# Altium project T1-T0ast.X2.PrjPcb (part 2 of 2)

## Sheet USB_SATA.SchDoc
size B; SheetNumber: 6; SheetTotal: 10
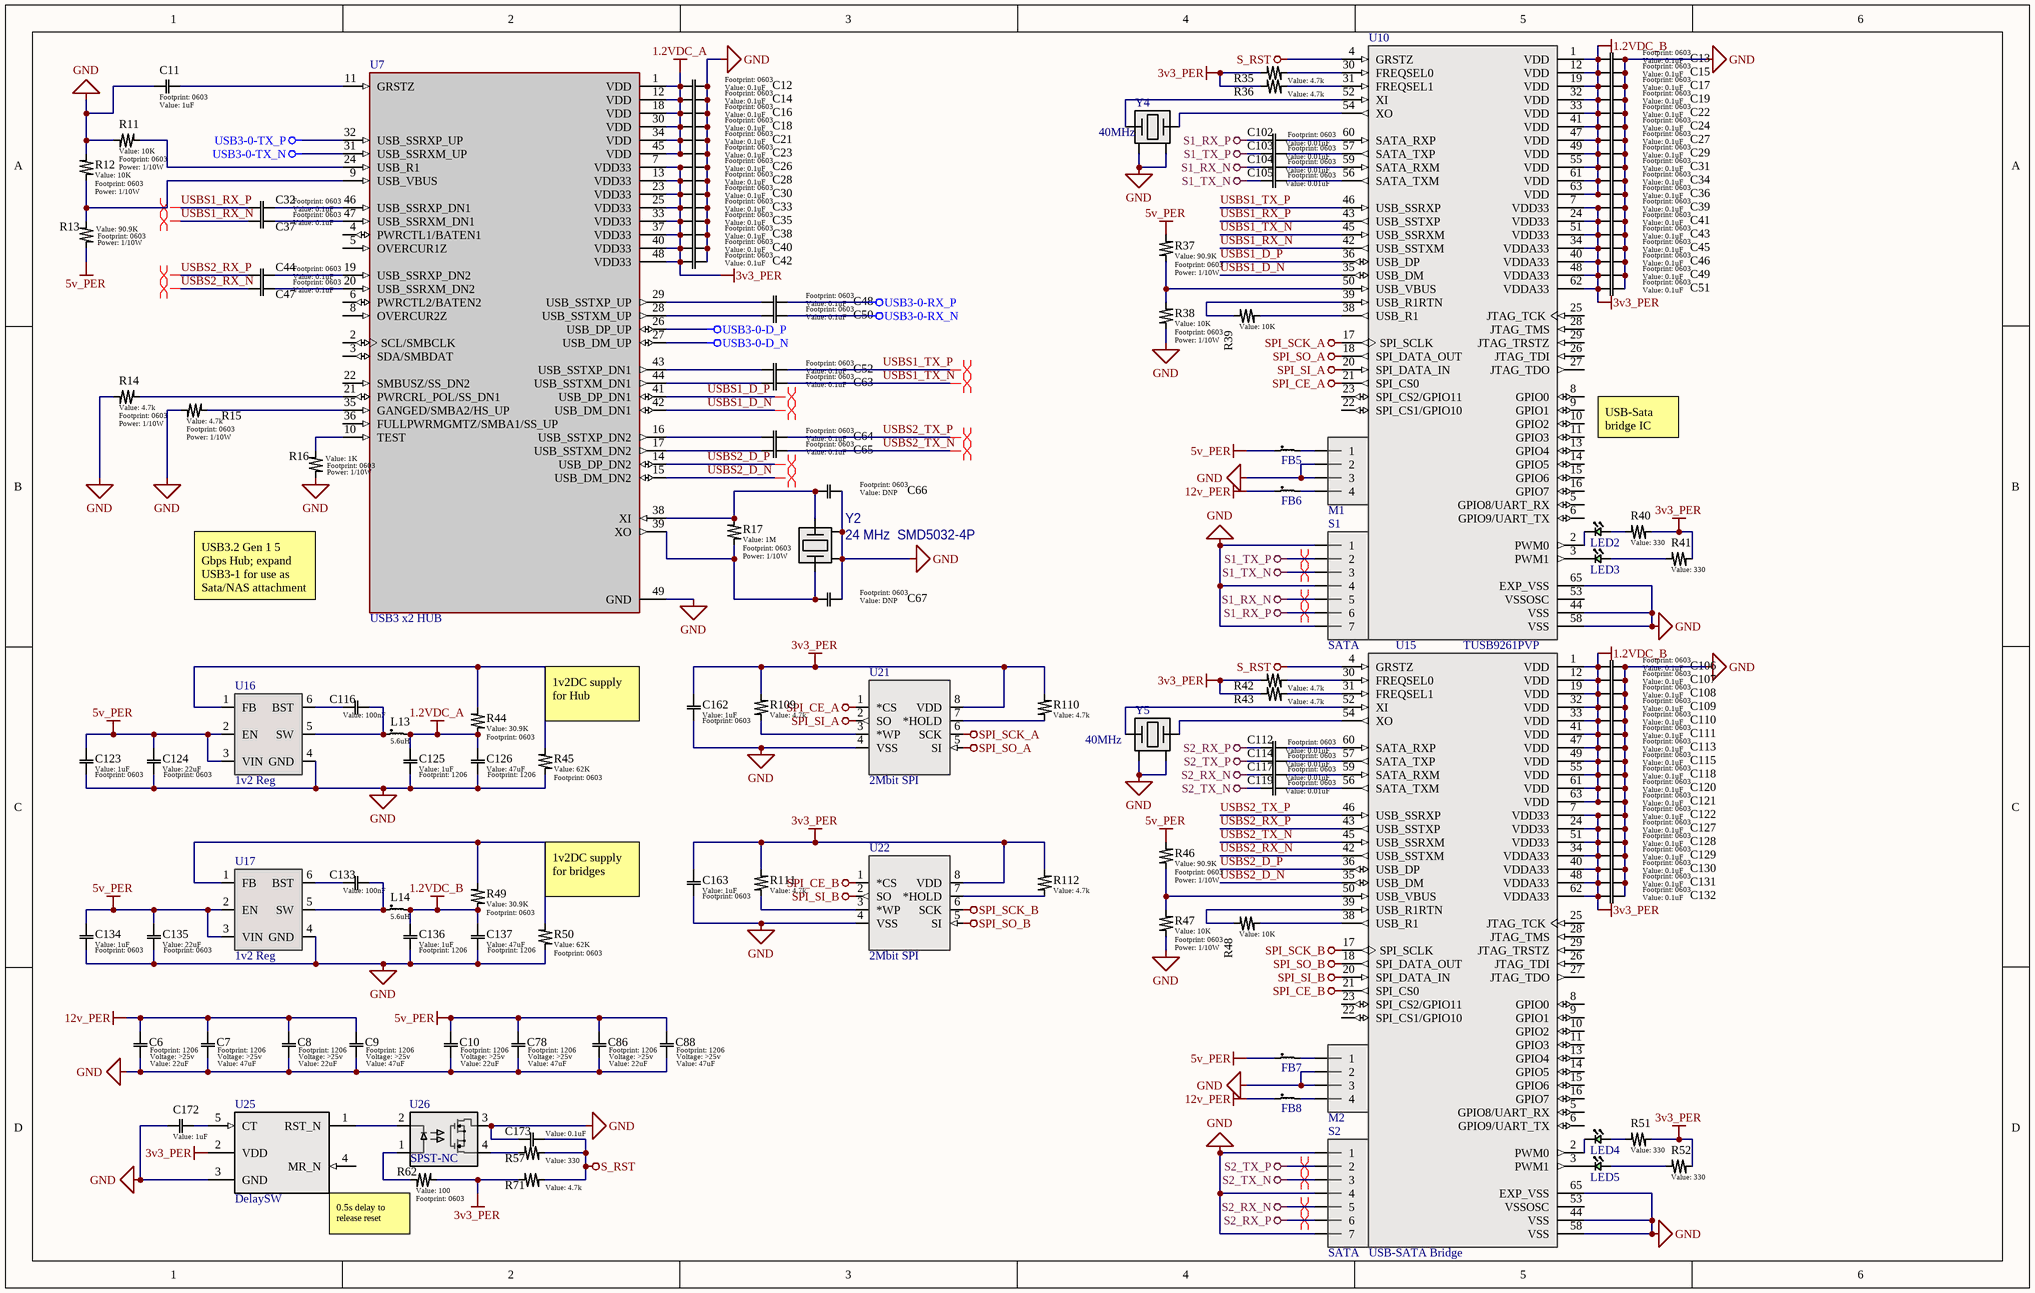
[diagram p3: USB_SATA.SchDoc]

### Parts
C6  value 22uF  Voltage: >25v  [1206]  (hidden comment: Generic Capacitor)
C7  value 47uF  Voltage: >25v  [1206]  (hidden comment: Generic Capacitor)
C8  value 22uF  Voltage: >25v  [1206]  (hidden comment: Generic Capacitor)
C9  value 47uF  Voltage: >25v  [1206]  (hidden comment: Generic Capacitor)
C10  value 22uF  Voltage: >25v  [1206]  (hidden comment: Generic Capacitor)
C11  value 1uF  [0603]  (hidden comment: Generic Capacitor)
C12  value 0.1uF  [0603]  (hidden comment: Generic Capacitor)
C13  value 0.1uF  [0603]  (hidden comment: Generic Capacitor)
C14  value 0.1uF  [0603]  (hidden comment: Generic Capacitor)
C15  value 0.1uF  [0603]  (hidden comment: Generic Capacitor)
C16  value 0.1uF  [0603]  (hidden comment: Generic Capacitor)
C17  value 0.1uF  [0603]  (hidden comment: Generic Capacitor)
C18  value 0.1uF  [0603]  (hidden comment: Generic Capacitor)
C19  value 0.1uF  [0603]  (hidden comment: Generic Capacitor)
C21  value 0.1uF  [0603]  (hidden comment: Generic Capacitor)
C22  value 0.1uF  [0603]  (hidden comment: Generic Capacitor)
C23  value 0.1uF  [0603]  (hidden comment: Generic Capacitor)
C24  value 0.1uF  [0603]  (hidden comment: Generic Capacitor)
C26  value 0.1uF  [0603]  (hidden comment: Generic Capacitor)
C27  value 0.1uF  [0603]  (hidden comment: Generic Capacitor)
C28  value 0.1uF  [0603]  (hidden comment: Generic Capacitor)
C29  value 0.1uF  [0603]  (hidden comment: Generic Capacitor)
C30  value 0.1uF  [0603]  (hidden comment: Generic Capacitor)
C31  value 0.1uF  [0603]  (hidden comment: Generic Capacitor)
C32  value 0.1uF  [0603]  (hidden comment: Generic Capacitor)
C33  value 0.1uF  [0603]  (hidden comment: Generic Capacitor)
C34  value 0.1uF  [0603]  (hidden comment: Generic Capacitor)
C35  value 0.1uF  [0603]  (hidden comment: Generic Capacitor)
C36  value 0.1uF  [0603]  (hidden comment: Generic Capacitor)
C37  value 0.1uF  [0603]  (hidden comment: Generic Capacitor)
C38  value 0.1uF  [0603]  (hidden comment: Generic Capacitor)
C39  value 0.1uF  [0603]  (hidden comment: Generic Capacitor)
C40  value 0.1uF  [0603]  (hidden comment: Generic Capacitor)
C41  value 0.1uF  [0603]  (hidden comment: Generic Capacitor)
C42  value 0.1uF  [0603]  (hidden comment: Generic Capacitor)
C43  value 0.1uF  [0603]  (hidden comment: Generic Capacitor)
C44  value 0.1uF  [0603]  (hidden comment: Generic Capacitor)
C45  value 0.1uF  [0603]  (hidden comment: Generic Capacitor)
C46  value 0.1uF  [0603]  (hidden comment: Generic Capacitor)
C47  value 0.1uF  [0603]  (hidden comment: Generic Capacitor)
C48  value 0.1uF  [0603]  (hidden comment: Generic Capacitor)
C49  value 0.1uF  [0603]  (hidden comment: Generic Capacitor)
C50  value 0.1uF  [0603]  (hidden comment: Generic Capacitor)
C51  value 0.1uF  [0603]  (hidden comment: Generic Capacitor)
C52  value 0.1uF  [0603]  (hidden comment: Generic Capacitor)
C63  value 0.1uF  [0603]  (hidden comment: Generic Capacitor)
C64  value 0.1uF  [0603]  (hidden comment: Generic Capacitor)
C65  value 0.1uF  [0603]  (hidden comment: Generic Capacitor)
C66  value DNP  [0603]  (hidden comment: Generic Capacitor)
C67  value DNP  [0603]  (hidden comment: Generic Capacitor)
C78  value 47uF  Voltage: >25v  [1206]  (hidden comment: Generic Capacitor)
C86  value 22uF  Voltage: >25v  [1206]  (hidden comment: Generic Capacitor)
C88  value 47uF  Voltage: >25v  [1206]  (hidden comment: Generic Capacitor)
C102  value 0.01uF  [0603]  (hidden comment: Generic Capacitor)
C103  value 0.01uF  [0603]  (hidden comment: Generic Capacitor)
C104  value 0.01uF  [0603]  (hidden comment: Generic Capacitor)
C105  value 0.01uF  [0603]  (hidden comment: Generic Capacitor)
C106  value 0.1uF  [0603]  (hidden comment: Generic Capacitor)
C107  value 0.1uF  [0603]  (hidden comment: Generic Capacitor)
C108  value 0.1uF  [0603]  (hidden comment: Generic Capacitor)
C109  value 0.1uF  [0603]  (hidden comment: Generic Capacitor)
C110  value 0.1uF  [0603]  (hidden comment: Generic Capacitor)
C111  value 0.1uF  [0603]  (hidden comment: Generic Capacitor)
C112  value 0.01uF  [0603]  (hidden comment: Generic Capacitor)
C113  value 0.1uF  [0603]  (hidden comment: Generic Capacitor)
C114  value 0.01uF  [0603]  (hidden comment: Generic Capacitor)
C115  value 0.1uF  [0603]  (hidden comment: Generic Capacitor)
C116  value 100nF  [0603]  (hidden comment: Generic Capacitor)
C117  value 0.01uF  [0603]  (hidden comment: Generic Capacitor)
C118  value 0.1uF  [0603]  (hidden comment: Generic Capacitor)
C119  value 0.01uF  [0603]  (hidden comment: Generic Capacitor)
C120  value 0.1uF  [0603]  (hidden comment: Generic Capacitor)
C121  value 0.1uF  [0603]  (hidden comment: Generic Capacitor)
C122  value 0.1uF  [0603]  (hidden comment: Generic Capacitor)
C123  value 1uF  [0603]  (hidden comment: Generic Capacitor)
C124  value 22uF  [0603]  (hidden comment: Generic Capacitor)
C125  value 1uF  [1206]  (hidden comment: Generic Capacitor)
C126  value 47uF  [1206]  (hidden comment: Generic Capacitor)
C127  value 0.1uF  [0603]  (hidden comment: Generic Capacitor)
C128  value 0.1uF  [0603]  (hidden comment: Generic Capacitor)
C129  value 0.1uF  [0603]  (hidden comment: Generic Capacitor)
C130  value 0.1uF  [0603]  (hidden comment: Generic Capacitor)
C131  value 0.1uF  [0603]  (hidden comment: Generic Capacitor)
C132  value 0.1uF  [0603]  (hidden comment: Generic Capacitor)
C133  value 100nF  [0603]  (hidden comment: Generic Capacitor)
C134  value 1uF  [0603]  (hidden comment: Generic Capacitor)
C135  value 22uF  [0603]  (hidden comment: Generic Capacitor)
C136  value 1uF  [1206]  (hidden comment: Generic Capacitor)
C137  value 47uF  [1206]  (hidden comment: Generic Capacitor)
C162  value 1uF  [0603]  (hidden comment: Generic Capacitor)
C163  value 1uF  [0603]  (hidden comment: Generic Capacitor)
C172  value 1uF  [0603]  (hidden comment: Generic Capacitor)
C173  value 0.1uF  [0603]  (hidden comment: Generic Capacitor)
FB5  1206 Ferrite  [1206]  (value not drawn)
FB6  1206 Ferrite  [1206]  (value not drawn)
FB7  1206 Ferrite  [1206]  (value not drawn)
FB8  1206 Ferrite  [1206]  (value not drawn)
L13  5.6uH  [TMPC0402HP]
L14  5.6uH  [TMPC0402HP]
LED2  LTST-C191KGKT  [0603 (1608 Metric) Concave]  (value not drawn)
LED3  LTST-C191KGKT  [0603 (1608 Metric) Concave]  (value not drawn)
LED4  LTST-C191KGKT  [0603 (1608 Metric) Concave]  (value not drawn)
LED5  LTST-C191KGKT  [0603 (1608 Metric) Concave]  (value not drawn)
M1  MATE-n-Lock  [794287-1]  (value not drawn)
M2  MATE-n-Lock  [794287-1]  (value not drawn)
R11  value 10K  Power: 1/10W  [0603]  (hidden comment: Generic Resistor)
R12  value 10K  Power: 1/10W  [0603]  (hidden comment: Generic Resistor)
R13  value 90.9K  Power: 1/10W  [0603]  (hidden comment: Generic Resistor)
R14  value 4.7k  Power: 1/10W  [0603]  (hidden comment: Generic Resistor)
R15  value 4.7k  Power: 1/10W  [0603]  (hidden comment: Generic Resistor)
R16  value 1K  Power: 1/10W  [0603]  (hidden comment: Generic Resistor)
R17  value 1M  Power: 1/10W  [0603]  (hidden comment: Generic Resistor)
R35  value 4.7k  [0603]  (hidden comment: Generic Resistor)
R36  value 4.7k  [0603]  (hidden comment: Generic Resistor)
R37  value 90.9K  Power: 1/10W  [0603]  (hidden comment: Generic Resistor)
R38  value 10K  Power: 1/10W  [0603]  (hidden comment: Generic Resistor)
R39  value 10K  [0603]  (hidden comment: Generic Resistor)
R40  value 330  [0603]  (hidden comment: Generic Resistor)
R41  value 330  [0603]  (hidden comment: Generic Resistor)
R42  value 4.7k  [0603]  (hidden comment: Generic Resistor)
R43  value 4.7k  [0603]  (hidden comment: Generic Resistor)
R44  value 30.9K  [0603]  (hidden comment: Generic Resistor)
R45  value 62K  [0603]  (hidden comment: Generic Resistor)
R46  value 90.9K  Power: 1/10W  [0603]  (hidden comment: Generic Resistor)
R47  value 10K  Power: 1/10W  [0603]  (hidden comment: Generic Resistor)
R48  value 10K  [0603]  (hidden comment: Generic Resistor)
R49  value 30.9K  [0603]  (hidden comment: Generic Resistor)
R50  value 62K  [0603]  (hidden comment: Generic Resistor)
R51  value 330  [0603]  (hidden comment: Generic Resistor)
R52  value 330  [0603]  (hidden comment: Generic Resistor)
R57  value 330  [0603]  (hidden comment: Generic Resistor)
R62  value 100  [0603]  (hidden comment: Generic Resistor)
R71  value 4.7k  [0603]  (hidden comment: Generic Resistor)
R109  value 4.7k  [0603]  (hidden comment: Generic Resistor)
R110  value 4.7k  [0603]  (hidden comment: Generic Resistor)
R111  value 4.7k  [0603]  (hidden comment: Generic Resistor)
R112  value 4.7k  [0603]  (hidden comment: Generic Resistor)
S1  SATA  [67800-8025]
S2  SATA  [67800-8025]
U7  USB3 x2 HUB  [HTQFP-48(7x7)]
U10  USB-SATA Bridge  [64-HTQFP (7x7)]  (value not drawn)
U15  USB-SATA Bridge  [64-HTQFP (7x7)]
U16  1v2 Reg  [TSOT-23-6]
U17  1v2 Reg  [TSOT-23-6]
U21  2Mbit SPI  [8-SOIC (0.154", 3.90mm Width)]
U22  2Mbit SPI  [8-SOIC (0.154", 3.90mm Width)]
U25  DelaySW  [TSOT-23-5]
U26  SPST-NC  [4-SOP]
Y2  24 MHz  SMD5032-4P  [ECS-240-18-30BQ-DS]
Y4  40MHz  [SMD3225-4P]
Y5  40MHz  [SMD3225-4P]

### Nets
1.2VDC_A: C12.2 C14.2 C16.2 C18.2 C21.2 C23.2 C125.1 C126.1 L13.2 R44.1 U7.1(VDD) U7.12(VDD) U7.18(VDD) U7.30(VDD) U7.34(VDD) U7.45(VDD)
1.2VDC_B: C13.2 C15.2 C17.2 C19.2 C22.2 C24.2 C27.2 C29.2 C31.2 C34.2 C36.2 C106.2 C107.2 C108.2 C109.2 C110.2 C111.2 C113.2 C115.2 C118.2 C120.2 C121.2 C136.1 C137.1 L14.2 R49.1 U10.1(VDD) U10.12(VDD) U10.19(VDD) U10.32(VDD) U10.33(VDD) U10.41(VDD) U10.47(VDD) U10.49(VDD) U10.55(VDD) U10.61(VDD) U10.63(VDD) U15.1(VDD) U15.12(VDD) U15.19(VDD) U15.32(VDD) U15.33(VDD) U15.41(VDD) U15.47(VDD) U15.49(VDD) U15.55(VDD) U15.61(VDD) U15.63(VDD)
3v3_PER: C26.2 C28.2 C30.2 C33.2 C35.2 C38.2 C39.2 C40.2 C41.2 C42.2 C43.2 C45.2 C46.2 C49.2 C51.2 C122.2 C127.2 C128.2 C129.2 C130.2 C131.2 C132.2 C162.1 C163.1 R35.1 R36.1 R40.2 R41.2 R42.1 R43.1 R51.2 R52.2 R62.2 R71.1 R109.1 R110.1 R111.1 R112.1 U7.7(VDD33) U7.13(VDD33) U7.23(VDD33) U7.25(VDD33) U7.33(VDD33) U7.37(VDD33) U7.40(VDD33) U7.48(VDD33) U10.7(VDD33) U10.24(VDD33) U10.34(VDDA33) U10.40(VDDA33) U10.48(VDDA33) U10.51(VDD33) U10.62(VDDA33) U15.7(VDD33) U15.24(VDD33) U15.34(VDDA33) U15.40(VDDA33) U15.48(VDDA33) U15.51(VDD33) U15.62(VDDA33) U21.8(VDD) U22.8(VDD) U25.2(VDD)
5v_PER: C10.1 C78.1 C86.1 C88.1 C123.1 C124.1 C134.1 C135.1 FB5.1 FB7.1 R13.1 R37.1 R46.1 U16.2(EN) U16.3(VIN) U17.2(EN) U17.3(VIN)
12v_PER: C6.1 C7.1 C8.1 C9.1 FB6.1 FB8.1
GND: C6.2 C7.2 C8.2 C9.2 C10.2 C11.1 C12.1 C13.1 C14.1 C15.1 C16.1 C17.1 C18.1 C19.1 C21.1 C22.1 C23.1 C24.1 C26.1 C27.1 C28.1 C29.1 C30.1 C31.1 C33.1 C34.1 C35.1 C36.1 C38.1 C39.1 C40.1 C41.1 C42.1 C43.1 C45.1 C46.1 C49.1 C51.1 C66.1 C67.1 C78.2 C86.2 C88.2 C106.1 C107.1 C108.1 C109.1 C110.1 C111.1 C113.1 C115.1 C118.1 C120.1 C121.1 C122.1 C123.2 C124.2 C125.2 C126.2 C127.1 C128.1 C129.1 C130.1 C131.1 C132.1 C134.2 C135.2 C136.2 C137.2 C162.2 C163.2 C172.2 C173.1 M1.2 M1.3 M2.2 M2.3 R11.1 R12.1 R14.1 R15.1 R16.1 R38.1 R45.1 R47.1 R50.1 S1.1 S1.4 S1.7 S2.1 S2.4 S2.7 U7.49(GND) U10.44(VSS) U10.58(VSS) U10.65(EXP_VSS) U15.44(VSS) U15.58(VSS) U15.65(EXP_VSS) U16.4(GND) U17.4(GND) U21.4(VSS) U22.4(VSS) U25.3(GND) U26.3 Y2.2(GND) Y2.4(GND) Y4.2(GND) Y4.4(GND) Y5.2(GND) Y5.4(GND)
S1_RX_N: C104.2 S1.5
S1_RX_P: C102.2 S1.6
S1_TX_N: C105.2 S1.3
S1_TX_P: C103.2 S1.2
S2_RX_N: C117.2 S2.5
S2_RX_P: C112.2 S2.6
S2_TX_N: C119.2 S2.3
S2_TX_P: C114.2 S2.2
S_RST: C173.2 R57.2 R71.2 U10.4(GRSTZ) U15.4(GRSTZ)
SPI_CE_A: U10.21(SPI_CS0) U21.1(*CS)
SPI_CE_B: U15.21(SPI_CS0) U22.1(*CS)
SPI_SCK_A: U10.17(SPI_SCLK) U21.6(SCK)
SPI_SCK_B: U15.17(SPI_SCLK) U22.6(SCK)
SPI_SI_A: U10.20(SPI_DATA_IN) U21.2(SO)
SPI_SI_B: U15.20(SPI_DATA_IN) U22.2(SO)
SPI_SO_A: U10.18(SPI_DATA_OUT) U21.5(SI)
SPI_SO_B: U15.18(SPI_DATA_OUT) U22.5(SI)
USB3-0-D_N: U7.27(USB_DM_UP)
USB3-0-D_P: U7.26(USB_DP_UP)
USB3-0-RX_N: C50.1
USB3-0-RX_P: C48.1
USB3-0-TX_N: U7.31(USB_SSRXM_UP)
USB3-0-TX_P: U7.32(USB_SSRXP_UP)
USBS1_D_N: U7.42(USB_DM_DN1) U10.35(USB_DM)
USBS1_D_P: U7.41(USB_DP_DN1) U10.36(USB_DP)
USBS1_RX_N: C37.2 U10.42(USB_SSTXM)
USBS1_RX_P: C32.2 U10.43(USB_SSTXP)
USBS1_TX_N: C63.1 U10.45(USB_SSRXM)
USBS1_TX_P: C52.1 U10.46(USB_SSRXP)
USBS2_D_N: U7.15(USB_DM_DN2) U15.35(USB_DM)
USBS2_D_P: U7.14(USB_DP_DN2) U15.36(USB_DP)
USBS2_RX_N: C47.2 U15.42(USB_SSTXM)
USBS2_RX_P: C44.2 U15.43(USB_SSTXP)
USBS2_TX_N: C65.1 U15.45(USB_SSRXM)
USBS2_TX_P: C64.1 U15.46(USB_SSRXP)
NetC11_2: C11.2 U7.11(GRSTZ)
NetC32_1: C32.1 U7.46(USB_SSRXP_DN1)
NetC37_1: C37.1 U7.47(USB_SSRXM_DN1)
NetC44_1: C44.1 U7.19(USB_SSRXP_DN2)
NetC47_1: C47.1 U7.20(USB_SSRXM_DN2)
NetC48_2: C48.2 U7.29(USB_SSTXP_UP)
NetC50_2: C50.2 U7.28(USB_SSTXM_UP)
NetC52_2: C52.2 U7.43(USB_SSTXP_DN1)
NetC63_2: C63.2 U7.44(USB_SSTXM_DN1)
NetC64_2: C64.2 U7.16(USB_SSTXP_DN2)
NetC65_2: C65.2 U7.17(USB_SSTXM_DN2)
NetC66_2: C66.2 R17.1 U7.38(XI) Y2.3
NetC67_2: C67.2 R17.2 U7.39(XO) Y2.1
NetC102_1: C102.1 U10.60(SATA_RXP)
NetC103_1: C103.1 U10.57(SATA_TXP)
NetC104_1: C104.1 U10.59(SATA_RXM)
NetC105_1: C105.1 U10.56(SATA_TXM)
NetC112_1: C112.1 U15.60(SATA_RXP)
NetC114_1: C114.1 U15.57(SATA_TXP)
NetC116_1: C116.1 U16.6(BST)
NetC116_2: C116.2 L13.1 U16.5(SW)
NetC117_1: C117.1 U15.59(SATA_RXM)
NetC119_1: C119.1 U15.56(SATA_TXM)
NetC133_1: C133.1 U17.6(BST)
NetC133_2: C133.2 L14.1 U17.5(SW)
NetC172_1: C172.1 U25.5(CT)
NetFB5_2: FB5.2 M1.1
NetFB6_2: FB6.2 M1.4
NetFB7_2: FB7.2 M2.1
NetFB8_2: FB8.2 M2.4
NetLED2_1: LED2.1(Cathode) U10.2(PWM0)
NetLED2_2: LED2.2(Anode) R40.1
NetLED3_1: LED3.1(Cathode) U10.3(PWM1)
NetLED3_2: LED3.2(Anode) R41.1
NetLED4_1: LED4.1(Cathode) U15.2(PWM0)
NetLED4_2: LED4.2(Anode) R51.1
NetLED5_1: LED5.1(Cathode) U15.3(PWM1)
NetLED5_2: LED5.2(Anode) R52.1
NetR11_2: R11.2 U7.24(USB_R1)
NetR12_2: R12.2 R13.2 U7.9(USB_VBUS)
NetR14_2: R14.2 U7.21(PWRCRL_POL/SS_DN1)
NetR15_2: R15.2 U7.35(GANGED/SMBA2/HS_UP)
NetR16_2: R16.2 U7.10(TEST)
NetR35_2: R35.2 U10.30(FREQSEL0)
NetR36_2: R36.2 U10.31(FREQSEL1)
NetR37_2: R37.2 R38.2 U10.50(USB_VBUS)
NetR39_1: R39.1 U10.39(USB_R1RTN)
NetR39_2: R39.2 U10.38(USB_R1)
NetR42_2: R42.2 U15.30(FREQSEL0)
NetR43_2: R43.2 U15.31(FREQSEL1)
NetR44_2: R44.2 R45.2 U16.1(FB)
NetR46_2: R46.2 R47.2 U15.50(USB_VBUS)
NetR48_1: R48.1 U15.39(USB_R1RTN)
NetR48_2: R48.2 U15.38(USB_R1)
NetR49_2: R49.2 R50.2 U17.1(FB)
NetR57_1: R57.1 U26.4
NetR62_1: R62.1 U26.1
NetR109_2: R109.2 U21.3(*WP)
NetR110_2: R110.2 U21.7(*HOLD)
NetR111_2: R111.2 U22.3(*WP)
NetR112_2: R112.2 U22.7(*HOLD)
NetU10_52: U10.52(XI) Y4.3
NetU10_54: U10.54(XO) Y4.1
NetU15_52: U15.52(XI) Y5.3
NetU15_54: U15.54(XO) Y5.1
NetU25_1: U25.1(RST_N) U26.2

Not connected (* = marked no-connect by the designer): U7 2(SCL/SMBCLK) 3(SDA/SMBDAT) 4(PWRCTL1/BATEN1) 5(OVERCUR1Z) 6(PWRCTL2/BATEN2) 8(OVERCUR2Z) 22(SMBUSZ/SS_DN2) 36(FULLPWRMGMTZ/SMBA1/SS_UP); U10 5(GPIO8/UART_RX) 6(GPIO9/UART_TX) 8(GPIO0) 9(GPIO1) 10(GPIO2) 11(GPIO3) 13(GPIO4) 14(GPIO5) 15(GPIO6) 16(GPIO7) 22(SPI_CS1/GPIO10) 23(SPI_CS2/GPIO11) 25(JTAG_TCK) 26(JTAG_TDI) 27(JTAG_TDO) 28(JTAG_TMS) 29(JTAG_TRSTZ) 53(VSSOSC); U15 5(GPIO8/UART_RX) 6(GPIO9/UART_TX) 8(GPIO0) 9(GPIO1) 10(GPIO2) 11(GPIO3) 13(GPIO4) 14(GPIO5) 15(GPIO6) 16(GPIO7) 22(SPI_CS1/GPIO10) 23(SPI_CS2/GPIO11) 25(JTAG_TCK) 26(JTAG_TDI) 27(JTAG_TDO) 28(JTAG_TMS) 29(JTAG_TRSTZ) 53(VSSOSC); U25 4(MR_N)

### Layout directives
differential pair: S1_RX_N, S1_RX_P, S1_TX_N, S1_TX_P, S2_RX_N, S2_RX_P, S2_TX_N, S2_TX_P, USBS1_D_N, USBS1_D_P, USBS1_RX_N, USBS1_RX_P, USBS1_TX_N, USBS1_TX_P, USBS2_D_N, USBS2_D_P, USBS2_RX_N, USBS2_RX_P, USBS2_TX_N, USBS2_TX_P

### Notes on the sheet
- (near U10) USB-Sata bridge IC
- USB3.2 Gen 1 5
  Gbps Hub; expand USB3-1 for use as Sata/NAS attachment
- 1v2DC supply for Hub
- 1v2DC supply for bridges
- 0.5s delay to release reset
- REV
- REVISIONS
- DATE
- DESCRIPTION
- BY
- UNLESS OTHERWISE SPECIFIED, DRAWING DEFINITIONS AND TOLERANCES SHALL BE FOUND UNDER SUPPLIER STANDARDS SS-001. THIS PART AND ALL COMPONENTS OF IT MUST BE RoHS & REACH COMPLIANT. A CERTIFICATE OF COMPLIANCE MUST BE PROVIDED UPON REQUEST.
- ALL INFORMATION ON THIS DOCUMENT IS THE SOLE PROPERTY OF GAMBER-JOHNSON AND SHALL NOT BE COPIED, REPRODUCED, USED OR DISCLOSED IN WHOLE OR IN PART WITHOUT THE WRITTEN CONSENT OF GAMBER-JOHNSON
- TOLERANCES
  .00 ± .060
  .000 ± .020
  .0000 ± .005
  ANGELS ± 1°
- DRAWN BY:
- PROJECT NUMBER:
- SHEET TITLE:
- SHEET
- OF
- DATE:
- LOCATION:
- ASSEMBLY NUMBER
- SIZE
- GAMBER-JOHNSON LLC
  5001 JOERNS DR.
  STEVENS POINT, WI 54481
  +1 (715) 344-5209
- B

### Library data of the parts
C6-C10 C78 C86 C88 = Generic Capacitor: Tolerance: 20%
C11 C66 C67 C116 C123-C126 C133-C137 C162 C163 = Generic Capacitor: Voltage: >10V; Tolerance: 10%
C12-C19 C21-C24 C26-C52 C63-C65 C102-C115 C117-C122 C127-C132 C172 C173 = Generic Capacitor: Voltage: 10V; Tolerance: 10%
FB5-FB8 = HI1206T161R-10: 160 Ohms @ 100MHz 1 Power, Signal Line Ferrite Bead 1206 (3216 Metric) 6A 18mOhm; Manufacturer 1: Laird Steward; DC Resistance (DCR): 18mR; Number of Lines: 1; Impedance: 160R; Supplier 1: Digi-Key; Manufacturer Part Number 1: HI1206T161R-10; RoHS: Yes; Category: Fixed Inductors; Stock 1: 250713; Pricing 1: 1=0.20000, 10=0.15600, 25=0.12920, 50=0.11140, 100=0.10020, 250=0.08464, 500=0.07572, 1000=0.06458 (USD); Mount: Surface Mount; Case/Package: 1206; Weight: 0.0136oz; Case Code (Metric): 3216; Case Code (Imperial): 1206; Core Material: Ferrite; Material: Ferrite; Min Operating Temperature: -40°C; Max Operating Temperature: 125°C; Package Quantity: 1; Packaging: Tape and Reel; Max Current Rating: 6A; Current Rating: 6A; Max DC Current: 6A; Termination: SMD/SMT; Frequency: 100MHz; Test Frequency: 100MHz; Length: 3.2mm; Height: 0.071inch; Width: 0.063inch; Depth: 1.8mm; Lead Free: Lead Free; REACH SVHC: Unknown; ComponentLink1URL: https://datasheet.ciiva.com/22622/1685743-22622771.pdf?src-supplier=Element14; ComponentLink1Description: https://datasheet.ciiva.com/22622/1685743-22622771.pdf?src-supplier=Element14; ComponentLink2URL: https://datasheet.ciiva.com/16714/70065439-16714326.pdf?src-supplier=Allied+Electronics; ComponentLink2Description: https://datasheet.ciiva.com/16714/70065439-16714326.pdf?src-supplier=Allied+Electronics; Supplier Part Number 1: 240-2411-1-ND; LCSC PN: C2926396
L13 L14 = TMPC0402HP-5R6MG-Z02: 2A 5.6uH ±20% SMD Power Inductor; LCSC PN: C357137; Supplier 1: Digi-Key; Supplier Part Number 1: 732-3339-1-ND
LED2-LED5 = CMP-013-000000-1: LED Uni-Color Green 574nm 2-Pin Chip LED T/R; Manufacturer 1: Vishay Lite-On; Number of Elements: 1; Viewing Angle: 130°; Lens Transparency: Clear; Power Dissipation: 75mW; Test Current: 20mA; Lens Style: Rectangular,Colorless; Reverse Voltage: 5V; Lens Color: Colorless; Forward Current: 30mA; Dominant Wavelength: 571nm; Forward Voltage: 2V; Luminous Intensity: 35mcd; Case Code (Imperial): 0603; Width: 0.8mm; Depth: 0.8mm; Case Code (Metric): 1608; Packaging: Tape and Reel; Number of LEDs: 1; Lead Free: Lead Free; Package Quantity: 1; Illumination Color: Green; Design Item ID: LTST-C191KGKT; Color: Green; Mount: Surface Mount; Source: Diodes.SchLib; Radiation Hardening: No; Wavelength: 574nm; RoHS: Yes; Max Power Dissipation: 75mW; RoHS Compliant: Yes; Power Rating: 75mW; Case/Package: 0603; Length: 1.6mm; Component Type: Standard; Number of Pins: 2; Height: 0.55mm; Stock 1: 4150; Pin Count: 2; ComponentLink1Description: https://datasheet.ciiva.com/2109/ltst-c191kgkt-2109973.pdf?src-supplier=Digi-Key; Manufacturer Part Number 1: LTST-C191KGKT; Category: LEDs; Min Operating Temperature: -55°C; ComponentLink1URL: https://datasheet.ciiva.com/2109/ltst-c191kgkt-2109973.pdf?src-supplier=Digi-Key; Max Operating Temperature: 85°C; Pricing 1: 50=0.14800, 250=0.06800, 500=0.06400, 1250=0.05400, 2500=0.05100 (USD)
M1 M2 = 794287-1: 4 Position Header Connector 0.200" (5.08mm) Through Hole Tin; Mfr_Name: TE Connectivity; TYPE: -; RefDes: RefDes
R11-R17 R37 R38 R46 R47 = Generic Resistor: Tolerance: 1%
R35 R36 R39-R45 R48-R52 R57 R62 R71 R109-R112 = Generic Resistor: Tolerance: 1%; Power: 1/10W
S1 S2 = 67800-8025: 7 Position SATA Header, Shrouded Connector Solder Through Hole; Mfr_Name: Molex Connector Corporation; RefDes: RefDes; Type: Type; LCSC PN: C7500843
U7 = TUSB8020BPHP: USB Hub Controller USB 3.0; LCSC PN: C205982; Supplier 1: Mouser; Supplier Part Number 1: 595-TUSB8020BPHP
U10 U15 = TUSB9261PVP: HDD, CD, DVD Drive Interface 64-HTQFP _7x7_; MF: Texas Instruments; Package: HTQFP-64 Texas Instruments; Digi-Key_Part_Number: 296-28827-ND; MP: TUSB9261PVP; SnapEDA_Link: https://www.snapeda.com/parts/TUSB9261PVP/Texas%20Instruments/view-part/1218116/?ref=snap; Digi-Key_Purchase_URL: https://www.digikey.com/product-detail/en/texas-instruments/TUSB9261PVP/296-28827-ND/2674328?utm_source=snapeda&utm_medium=aggregator&utm_campaign=symbol; Value: *; LCSC PN: C913832
U16 U17 = AP63201WU-7: Step-down type Adjustable 2A 1.2V~12V 3.8V~32V TSOT-23-6 DC-DC Converter; LCSC PN: C2071044; Supplier 1: Future Electronics; Supplier Part Number 1: 5109504
U21 U22 = LE25U20AMB-AH: IC FLASH 2MBIT SPI 30MHZ 8SOP; Mfr_Name: onsemi; RefDes: RefDes; Type: Type; LCSC PN: C409019
U25 = TPS3840DL22DBVR: Supervisor Open Drain or Open Collector 1 Channel SOT-23-5 / 2.2V Threshold; Mfr_Name: Texas Instruments; TYPE: TYPE; RefDes: RefDes; LCSC PN: C2867913; Supplier 1: Mouser; Supplier Part Number 1: 595-TPS3840DL22DBVR
U26 = CPC1117N: SSR RELAY SPST-NC 400MA 0-60V; Mfr_Name: Littelfuse Inc; RefDes: RefDes; Type: Type; LCSC PN: C150424
Y2 = CMP-018-000001-1: 24 MHz ±30ppm Crystal 18pF 30 Ohms 4-SMD, No Lead; Pin Count: 4; Design Item ID: ECS-240-18-30BQ-DS; Component Type: Standard; Source: Misc ICs.SchLib; LCSC PN: C251601
Y4 Y5 = L327S400H11L: 40MHz Surface Mount Crystal 10pF ±10ppm SMD3225-4P Crystal; LCSC PN: C5261245

## Nets that join several sheets
3v3_PER: Docking_Connection (10 pins), USB2_Replication (27 pins), USB_SATA (63 pins)
3v3_PO: Docking_Connection (8 pins), USB2_Replication (U8.1)
5v_PER: Docking_Connection (J16.2 J16.4), USB2_Replication (6 pins), USB_Audio (C153.1 U14.2), USB_SATA (17 pins)
12v_PER: Docking_Connection (5 pins), USB_SATA (6 pins)
GND: Docking_Connection (137 pins), USB2_Replication (68 pins), USB_Audio (28 pins), USB_SATA (111 pins)
USB2_UP_N: Docking_Connection (HB.3 rPI1.103), USB2_Replication (U8.4)
USB2_UP_OTG: Docking_Connection (HB.1 rPI1.101), USB2_Replication (R20.2 R21.2 U8.2)
USB2_UP_P: Docking_Connection (HB.5 rPI1.105), USB2_Replication (U8.3)
USB3-0-D_N: Docking_Connection (HB.36 rPI1.136), USB_SATA (U7.27)
USB3-0-D_P: Docking_Connection (HB.34 rPI1.134), USB_SATA (U7.26)
USB3-0-RX_N: Docking_Connection (HB.28 rPI1.128), USB_SATA (C50.1)
USB3-0-RX_P: Docking_Connection (HB.30 rPI1.130), USB_SATA (C48.1)
USB3-0-TX_N: Docking_Connection (HB.40 rPI1.140), USB_SATA (U7.31)
USB3-0-TX_P: Docking_Connection (HB.42 rPI1.142), USB_SATA (U7.32)
USB1_D_N: USB2_Replication (U23.1), USB_Audio (R82.2)
USB1_D_P: USB2_Replication (U23.2), USB_Audio (R75.2 R80.2)